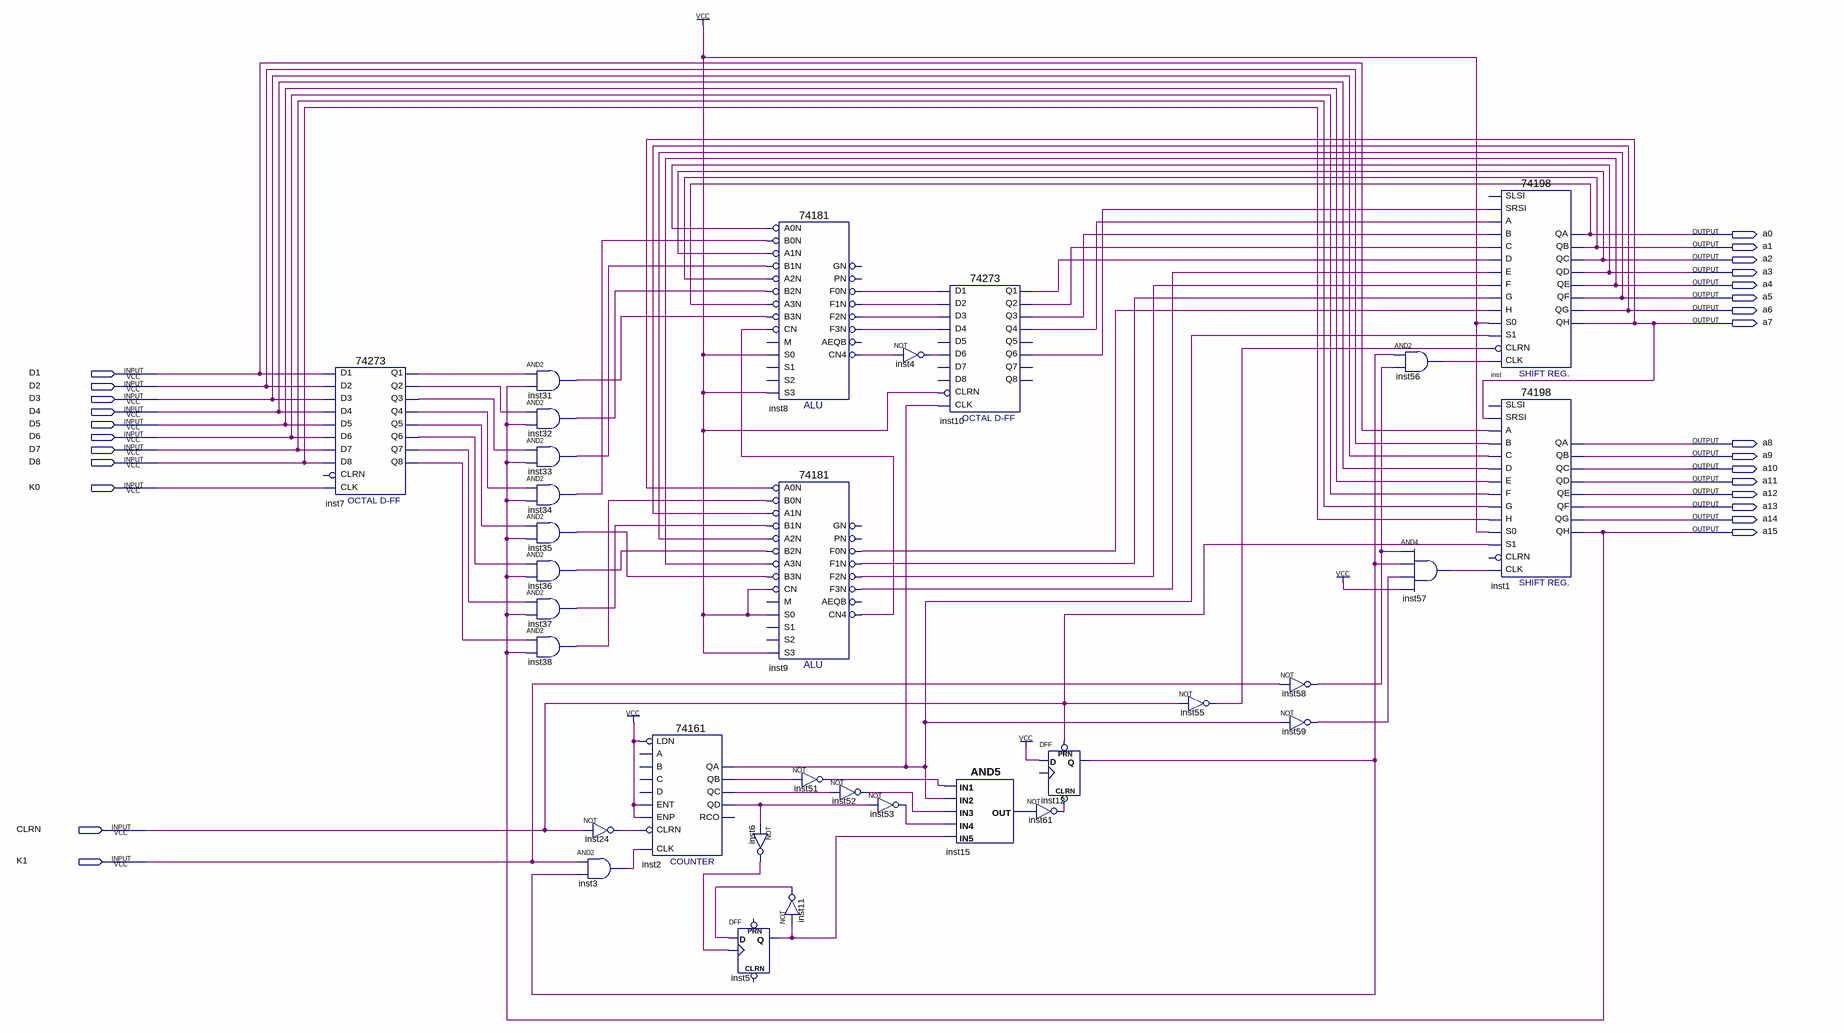
[diagram p0: schematic sheet]
// Quartus schematic ex2.bdf as structural Verilog: 32 symbols, 27 pins
module ex2 (
  input  D1,
  input  D2,
  input  D3,
  input  D4,
  input  D5,
  input  D6,
  input  D7,
  input  D8,
  input  K0,
  input  CLRN,
  input  K1,
  output a0,
  output a1,
  output a2,
  output a3,
  output a4,
  output a5,
  output a6,
  output a7,
  output a8,
  output a9,
  output a10,
  output a11,
  output a12,
  output a13,
  output a14,
  output a15
);

  wire inst2_qa, inst2_qb, inst2_qc, inst2_qd, inst3_out, inst4_out, inst5_q, inst6_out, inst7_q1, inst7_q2,
       inst7_q3, inst7_q4, inst7_q5, inst7_q6, inst7_q7, inst7_q8, inst8_cn4, inst8_f0n, inst8_f1n,
       inst8_f2n, inst8_f3n, inst9_cn4, inst9_f0n, inst9_f1n, inst9_f2n, inst9_f3n, inst10_q1, inst10_q2,
       inst10_q3, inst10_q4, inst10_q6, inst11_out, inst12_q, inst15_out, inst24_out, inst31_out, inst32_out,
       inst33_out, inst34_out, inst35_out, inst36_out, inst37_out, inst38_out, inst51_out, inst52_out,
       inst53_out, inst55_out, inst56_out, inst57_out, inst58_out, inst59_out, inst61_out;

  \74273  inst7 (
    .D2(D2), .D3(D3), .D1(D1), .D4(D4), .D7(D7), .D6(D6), .D5(D5), .D8(D8), .CLK(K0), .Q4(inst7_q4),
    .Q1(inst7_q1), .Q2(inst7_q2), .Q3(inst7_q3), .Q6(inst7_q6), .Q5(inst7_q5), .Q7(inst7_q7), .Q8(inst7_q8));  // open: CLRN
  and inst31 (inst31_out, inst7_q1, a15);
  and inst32 (inst32_out, inst7_q2, a15);
  and inst33 (inst33_out, inst7_q3, a15);
  and inst34 (inst34_out, inst7_q4, a15);
  and inst35 (inst35_out, inst7_q5, a15);
  and inst36 (inst36_out, inst7_q6, a15);
  and inst37 (inst37_out, inst7_q7, a15);
  and inst38 (inst38_out, inst7_q8, a15);
  not inst24 (inst24_out, CLRN);
  and inst3 (inst3_out, K1, inst12_q);
  \74161  inst2 (
    .CLRN(inst24_out), .CLK(inst3_out), .ENP(1'b1), .LDN(1'b1), .ENT(1'b1), .QD(inst2_qd), .QC(inst2_qc),
    .QB(inst2_qb), .QA(inst2_qa));  // open: A, D, B, C, RCO
  not inst6 (inst6_out, inst2_qd);
  DFF inst5 (.CLK(inst6_out), .D(inst11_out), .Q(inst5_q));  // open: CLRN, PRN
  \74181  inst8 (
    .B0N(inst34_out), .A0N(a3), .A1N(a2), .B1N(inst33_out), .A3N(a0), .B2N(inst32_out), .A2N(a1),
    .CN(inst9_cn4), .B3N(inst31_out), .S0(1'b1), .S3(1'b1), .F3N(inst8_f3n), .F1N(inst8_f1n),
    .F0N(inst8_f0n), .CN4(inst8_cn4), .F2N(inst8_f2n));  // open: M, S2, S1, PN, GN, AEQB
  \74181  inst9 (
    .B0N(inst38_out), .A0N(a7), .A1N(a6), .B1N(inst37_out), .A3N(a4), .B2N(inst36_out), .A2N(a5), .CN(1'b1),
    .B3N(inst35_out), .S0(1'b1), .S3(1'b1), .F3N(inst9_f3n), .F1N(inst9_f1n), .F0N(inst9_f0n),
    .CN4(inst9_cn4), .F2N(inst9_f2n));  // open: M, S2, S1, PN, GN, AEQB
  not inst51 (inst51_out, inst2_qb);
  not inst11 (inst11_out, inst5_q);
  not inst52 (inst52_out, inst2_qc);
  not inst4 (inst4_out, inst8_cn4);
  not inst53 (inst53_out, inst2_qd);
  \74273  inst10 (
    .D2(inst8_f1n), .D3(inst8_f2n), .D1(inst8_f0n), .D4(inst8_f3n), .D6(inst4_out), .CLK(inst2_qa),
    .CLRN(1'b1), .Q4(inst10_q4), .Q1(inst10_q1), .Q2(inst10_q2), .Q3(inst10_q3), .Q6(inst10_q6));  // open: D7, D5, D8, Q5, Q7, Q8
  and inst15 (inst15_out, inst51_out, inst2_qa, inst52_out, inst53_out, inst5_q);
  DFF inst12 (.CLRN(inst61_out), .D(1'b1), .PRN(CLRN), .Q(inst12_q));  // open: CLK
  not inst61 (inst61_out, inst15_out);
  not inst55 (inst55_out, CLRN);
  not inst58 (inst58_out, K1);
  not inst59 (inst59_out, inst2_qa);
  and inst56 (inst56_out, inst12_q, inst58_out);
  and inst57 (inst57_out, inst58_out, inst12_q, inst59_out, 1'b1);
  \74198  inst (
    .A(inst10_q4), .SRSI(inst10_q6), .E(inst9_f3n), .S0(1'b1), .B(inst10_q3), .C(inst10_q2), .D(inst10_q1),
    .H(inst9_f0n), .G(inst9_f1n), .CLRN(inst55_out), .CLK(inst56_out), .F(inst9_f2n), .S1(inst2_qa), .QD(a3),
    .QC(a2), .QH(a7), .QA(a0), .QB(a1), .QE(a4), .QF(a5), .QG(a6));  // open: SLSI
  \74198  inst1 (
    .A(D1), .SRSI(a7), .E(D5), .S0(1'b1), .B(D2), .C(D3), .D(D4), .H(D8), .G(D7), .CLK(inst57_out), .F(D6),
    .S1(CLRN), .QD(a11), .QC(a10), .QH(a15), .QA(a8), .QB(a9), .QE(a12), .QF(a13), .QG(a14));  // open: SLSI, CLRN
endmodule
